# EAGLE schematic VCO (EAGLE 7.5.0)
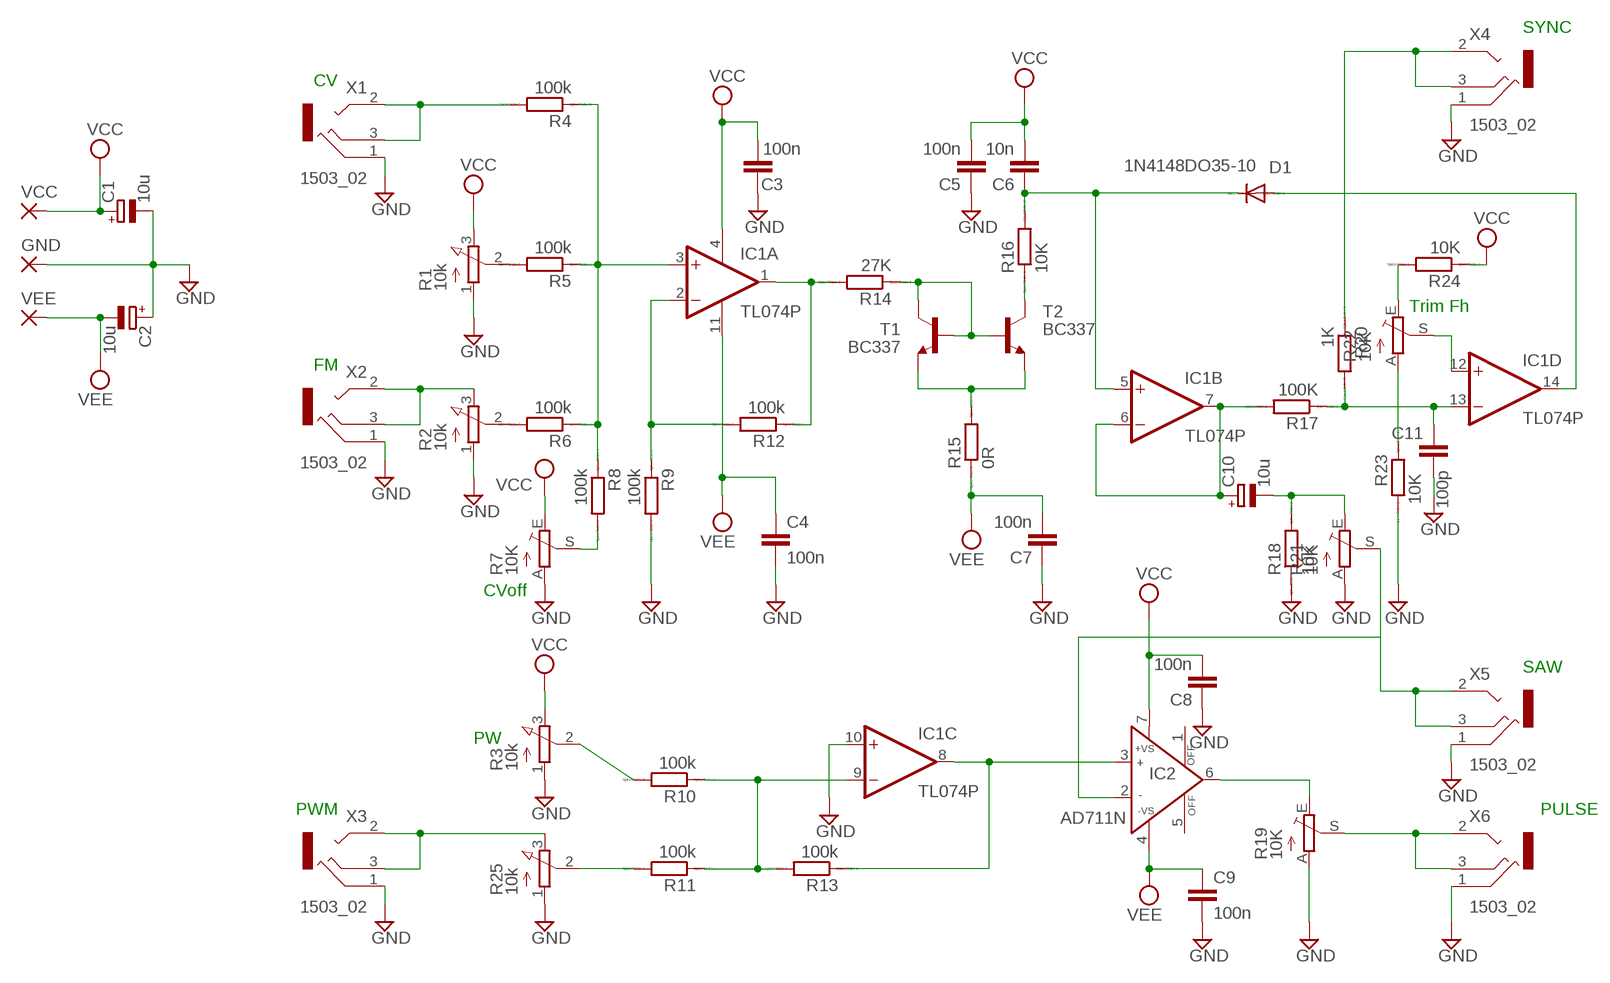
[diagram p0: schematic, sheet 1]

## Parts
C1  10u  CPOL-EUE2.5-7  [E2,5-7]
C2  10u  CPOL-EUE2.5-7  [E2,5-7]
C3  100n  C5/2.5  [C5B2.5]
C4  100n  C5/2.5  [C5B2.5]
C5  100n  C5/2.5  [C5B2.5]
C6  10n  C5/2.5  [C5B2.5]
C7  100n  C5/2.5  [C5B2.5]
C8  100n  C5/2.5  [C5B2.5]
C9  100n  C5/2.5  [C5B2.5]
C10  10u  CPOL-EUE2.5-7  [E2,5-7]
C11  100p  C2.5/2  [C2.5-2]
D1  1N4148DO35-10  [DO35-10]
GND  3,17/1,1  [3,17/1,1]
IC1  TL074P  [DIL14]
IC2  AD711N  [DIL08]
R1  10k  3RP/1610N  [3RP/1610N]
R2  10k  3RP/1610N  [3RP/1610N]
R3  10k  3RP/1610N  [3RP/1610N]
R4  100k  R0207/10  [0207/10]
R5  100k  R0207/10  [0207/10]
R6  100k  R0207/10  [0207/10]
R7  10K  TRIM_EU-CA6V  [CA6V]
R8  100k  R0207/10  [0207/10]
R9  100k  R0207/10  [0207/10]
R10  100k  R0207/10  [0207/10]
R11  100k  R0207/10  [0207/10]
R12  100k  R0207/10  [0207/10]
R13  100k  R0207/10  [0207/10]
R14  27K  R0207/10  [0207/10]
R15  0R  R0207/10  [0207/10]
R16  10K  R0207/10  [0207/10]
R17  100K  R0207/10  [0207/10]
R18  10K  R0207/10  [0207/10]
R19  10K  TRIM_EU-CA6V  [CA6V]
R20  1K  R0207/10  [0207/10]
R21  10K  TRIM_EU-CA6V  [CA6V]
R22  10K  TRIM_EU-CA6V  [CA6V]
R23  10K  R0207/10  [0207/10]
R24  10K  R0207/10  [0207/10]
R25  10k  3RP/1610N  [3RP/1610N]
T1  BC337  [TO92]
T2  BC337  [TO92]
VCC  3,17/1,1  [3,17/1,1]
VEE  3,17/1,1  [3,17/1,1]
X1  1503_02  [1503_02]
X2  1503_02  [1503_02]
X3  1503_02  [1503_02]
X4  1503_02  [1503_02]
X5  1503_02  [1503_02]
X6  1503_02  [1503_02]

## Nets
GND [Power]: C1.- C2.+ C3.1 C4.2 C5.1 C7.1 C8.1 C9.2 C11.1 GND.1(P) IC1.10(C:+IN) R1.1(A) R2.1(A) R3.1(A) R7.A R9.2 R18.1 R19.A R21.A R23.1 R25.1(A) X1.1 X2.1 X3.1 X4.1 X5.1 X6.1
N$1: R14.1 T1.2(B) T1.3(C) T2.2(B)
N$2: R15.2 T1.1(E) T2.1(E)
N$3: C6.1 D1.C IC1.5(B:+IN) R16.2
N$4: R16.1 T2.3(C)
N$5: D1.A IC1.14(D:OUT)
N$6: IC1.12(D:+IN) R22.S
N$7: C11.2 IC1.13(D:-IN) R17.1 R20.2
N$8: C10.+ IC1.6(B:-IN) IC1.7(B:OUT) R17.2
N$9: R22.A R23.2
N$10: R7.S R8.2
N$11: R22.E R24.2
N$12: R4.2 X1.2 X1.3
N$13: IC1.3(A:+IN) R4.1 R5.1 R6.1 R8.1
N$14: R2.2(S) R6.2
N$15: R20.1 X4.2 X4.3
N$16: R11.2 R25.2(S)
N$17: R1.2(S) R5.2
N$18: IC1.1(A:OUT) R12.1 R14.2
N$20: IC1.2(A:-IN) R9.1 R12.2
N$21: IC2.2(IN-) R21.S X5.2 X5.3
N$22: IC2.6(OUT) R19.E
N$23: R19.S X6.3
N$24: IC1.9(C:-IN) R10.1 R11.1 R13.2
N$25: C10.- R18.2 R21.E
N$26: R2.3(E) X2.2 X2.3
N$27: R3.2(S) R10.2
N$28: R25.3(E) X3.2 X3.3
N$29: IC1.8(C:OUT) IC2.3(IN+) R13.1
VCC [Power]: C1.+ C3.2 C5.2 C6.2 C8.2 IC2.7(+VS) R1.3(E) R3.3(E) R7.E R24.1 VCC.1(P)
VEE [Power]: C2.- C4.1 C7.2 C9.1 IC2.4(-VS) R15.1 VEE.1(P)
Unconnected: IC2.1(OFF) IC2.5(OFF) X1.2@2 X2.2@2 X3.2@2 X4.2@2 X5.2@2 X6.2 X6.2@2

## Notes on the sheet
- SYNC
- CV
- Trim Fh
- FM
- CVoff
- SAW
- PW
- PWM | PULSE

## Power pins joined to a net without a drawn wire
V+: IC1.4(P:V+)
V-: IC1.11(P:V-)

## Library data of the parts
C1 C2 C10 = rcl:CPOL-EU: POLARIZED CAPACITOR, European symbol
C3-C9 C11 = capacitor-wima:C: CAPACITOR naming: grid - package width
D1 = diode:1N4148: DIODE high speed (Philips)
GND VCC VEE = wirepad:3,17/1,1: THROUGH-HOLE PAD
IC1 = linear:TL074: OP AMP
IC2 = analog-devices:AD711: Precision, Low Cost, High Speed, BiFET Op Amp Source: http://www.analog.com/static/imported-files/data_sheets/AD711.pdf; MPN: AD711BQ; OC_FARNELL: 9604839; OC_NEWARK: 66F5826
R1-R3 R25 = pot:3RP/1610N: 16mm Potentiometer one level Source: http://www.alphapotentiometers.net/html/16mm_pot_2.html
R4-R6 R8-R14 = eagle-ltspice:R: RESISTOR, European symbol; SPICEMODEL: NONE; SPICEPREFIX: 27K
R7 R19 R21 R22 = pot:TRIM_EU-: POTENTIOMETER
R15 = eagle-ltspice:R: RESISTOR, European symbol; SPICEMODEL: NONE; SPICEPREFIX: R
R16 R18 R23 R24 = eagle-ltspice:R: RESISTOR, European symbol; SPICEMODEL: NONE; SPICEPREFIX: 10K
R17 R20 = eagle-ltspice:R: RESISTOR, European symbol; SPICEMODEL: NONE
T1 T2 = transistor:BC337: NPN TRANSISTOR
X1-X6 = con-lumberg:1503_02: Jack connectors according to JISC 6560, 3.5 mm Klinkeneinbaukupplung nach JISC 6560, 3,5 mm, 3-polig/stereo, abgewinkelte Ausführung, Surface-Mount-Technik (SMT) Source: http://www.lumberg.com/Produkte/PDFs/1503_02.pdf; OC_FARNELL: 1216979; OC_NEWARK: unknown

## Net classes
0 default: width 0.508 mm, clearance 0.508 mm
1 Power: width 1.016 mm, clearance 0.508 mm